# EAGLE board loa_v2c (EAGLE 6.5.0), part 1 of 2
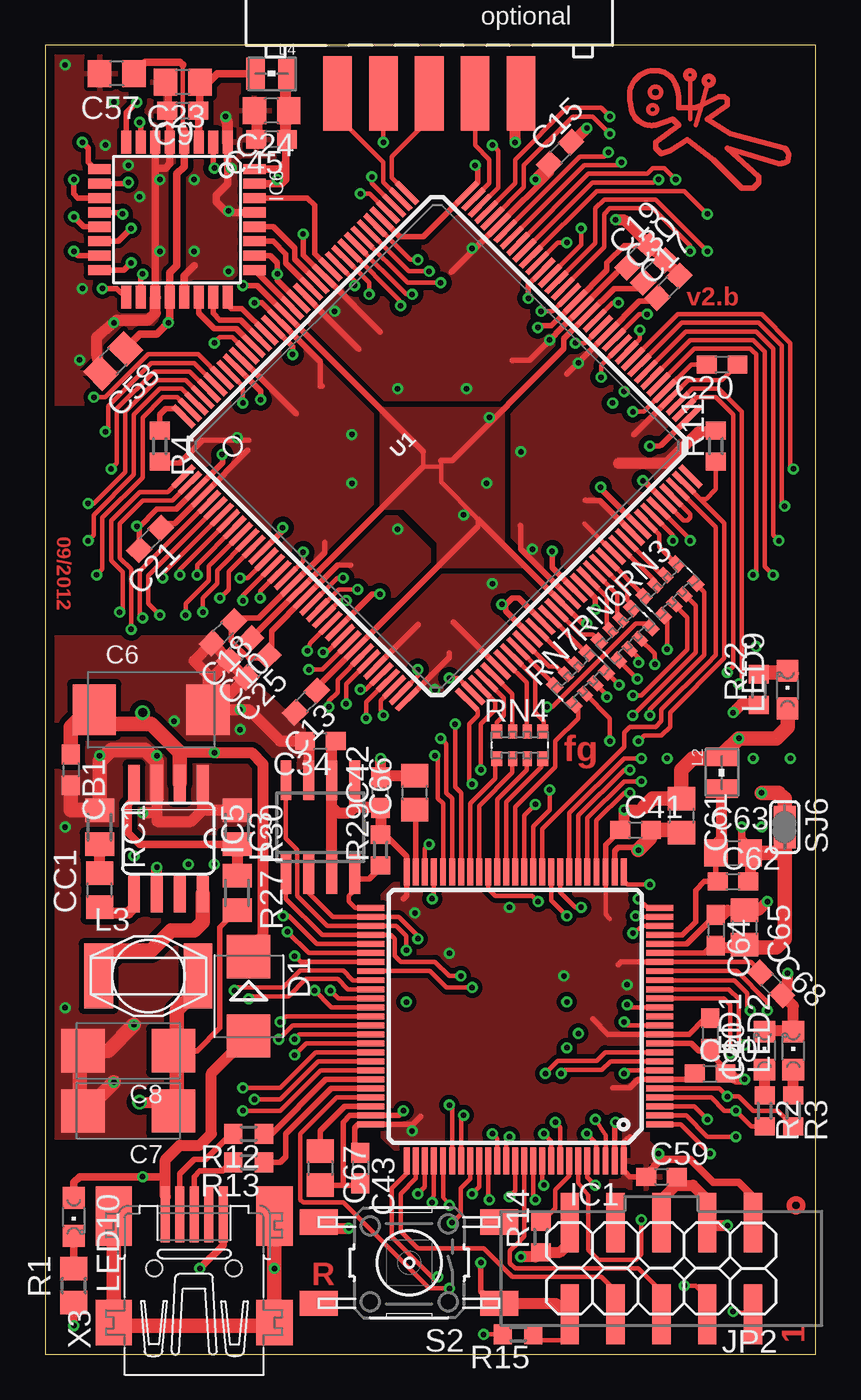
[diagram p7: board, top side]
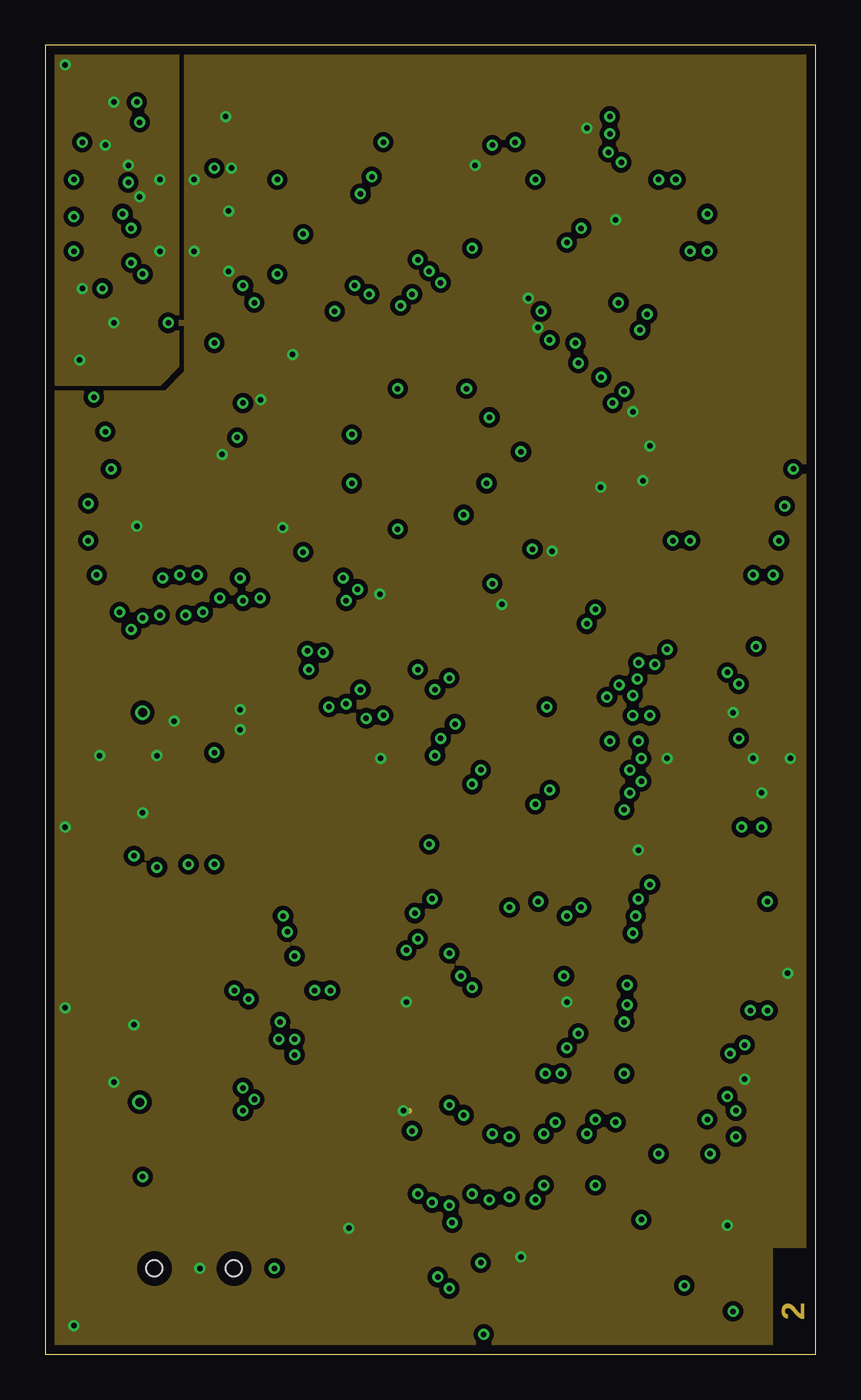
[diagram p8: board, inner layer GND]
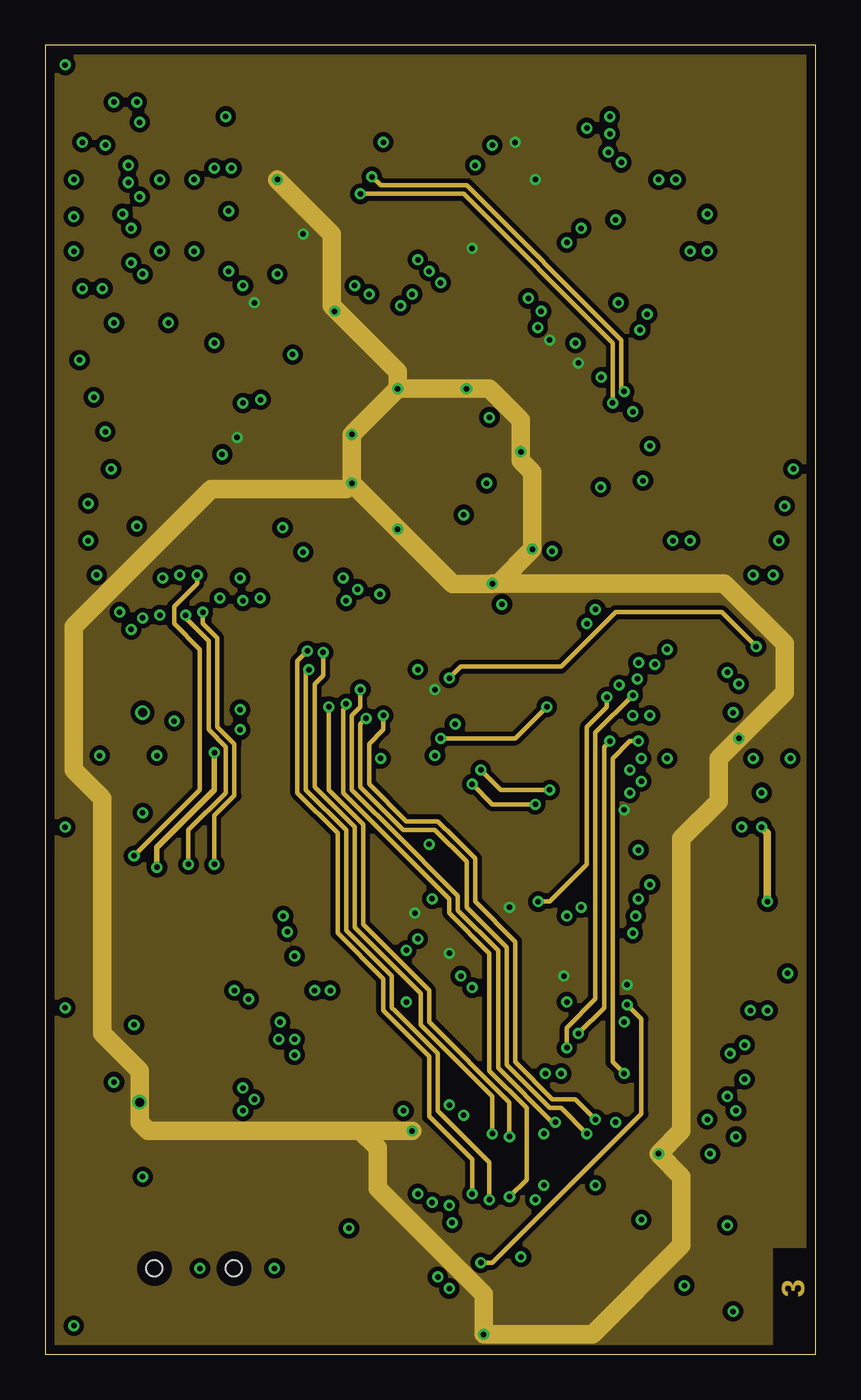
[diagram p9: board, inner layer Route15]
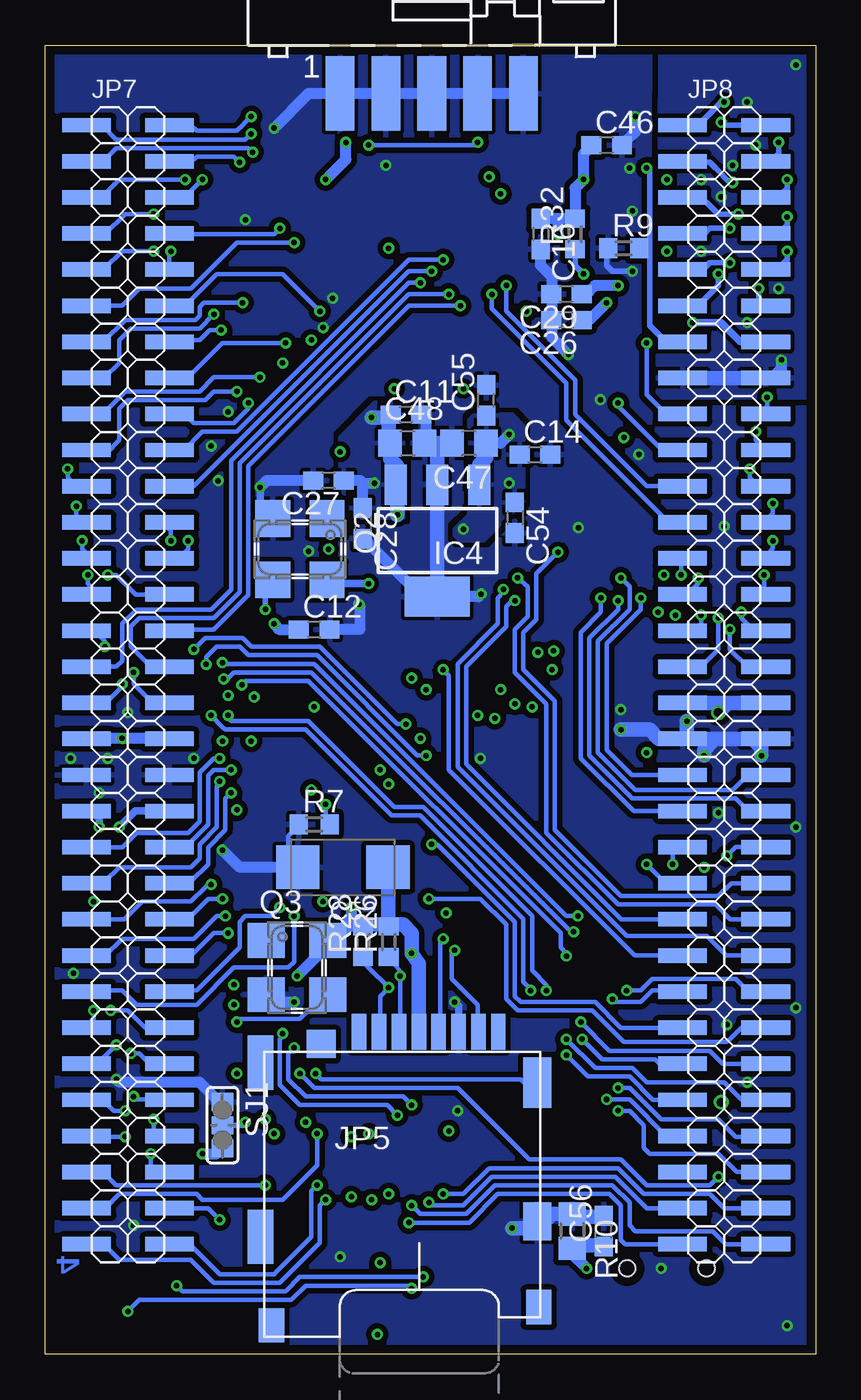
[diagram p10: board, bottom side, seen from below]

Size 42.68 x 72.54 mm. Coordinates in mm from the lower left corner, seen from the top.
Outline: 0,0 42.68,0 42.68,72.54 0,72.54 0,0
Copper layers (1+2*15+16): Top 0.035mm / dielectric 1.5mm / GND 0.035mm / dielectric 0.15mm / Route15 0.035mm / dielectric 0.2mm / Bottom 0.035mm
Design rules "PCB-POOL *": minimum track width 6mil, minimum drill 12mil, track to track 6mil, track to pad 6mil, pad to pad 6mil, via to via 6mil, smd to smd 6mil, copper to edge 20mil, drill to drill 8mil, minimum pad ring 8mil, minimum via ring 6mil, stop-mask expansion 12mil, vias tented up to drill 12mil, thermal gap 8mil

## Footprints (pad centres in the part's own frame; a part is rotated, then mirrored left to right if it is on the bottom)
SMC_D = smd 2.4 x 2.8: + -3.15,0; - 3.15,0
SMC_C = smd 2.4 x 2.4: + -2.5,0; - 2.5,0
C0603 = smd 1.1 x 1: 1 -0.85,0; 2 0.85,0
C0805 = smd 1.3 x 1.5: 1 -0.95,0; 2 0.95,0
SMB = smd 2.4 x 2.4: A 2.2,0; C -2.2,0
TQFP100 = smd 1.5 x 0.33: 1 -8,6; 2 -8,5.5; 3 -8,5; 4 -8,4.5; 5 -8,4; 6 -8,3.5; 7 -8,3; 8 -8,2.5; 9 -8,2; 10 -8,1.5; 11 -8,1; 12 -8,0.5; 13 -8,0; 14 -8,-0.5; 15 -8,-1; 16 -8,-1.5; 17 -8,-2; 18 -8,-2.5; 19 -8,-3; 20 -8,-3.5; 21 -8,-4; 22 -8,-4.5; 23 -8,-5; 24 -8,-5.5; 25 -8,-6; 51 8,-6; 52 8,-5.5; 53 8,-5; 54 8,-4.5; 55 8,-4; 56 8,-3.5; 57 8,-3; 58 8,-2.5; 59 8,-2; 60 8,-1.5; 61 8,-1; 62 8,-0.5; 63 8,0; 64 8,0.5; 65 8,1; 66 8,1.5; 67 8,2; 68 8,2.5; 69 8,3; 70 8,3.5; 71 8,4; 72 8,4.5; 73 8,5; 74 8,5.5; 75 8,6 | smd 0.33 x 1.5: 26 -6,-8; 27 -5.5,-8; 28 -5,-8; 29 -4.5,-8; 30 -4,-8; 31 -3.5,-8; 32 -3,-8; 33 -2.5,-8; 34 -2,-8; 35 -1.5,-8; 36 -1,-8; 37 -0.5,-8; 38 0,-8; 39 0.5,-8; 40 1,-8; 41 1.5,-8; 42 2,-8; 43 2.5,-8; 44 3,-8; 45 3.5,-8; 46 4,-8; 47 4.5,-8; 48 5,-8; 49 5.5,-8; 50 6,-8; 76 6,8; 77 5.5,8; 78 5,8; 79 4.5,8; 80 4,8; 81 3.5,8; 82 3,8; 83 2.5,8; 84 2,8; 85 1.5,8; 86 1,8; 87 0.5,8; 88 0,8; 89 -0.5,8; 90 -1,8; 91 -1.5,8; 92 -2,8; 93 -2.5,8; 94 -3,8; 95 -3.5,8; 96 -4,8; 97 -4.5,8; 98 -5,8; 99 -5.5,8; 100 -6,8
SO08 = smd 0.6 x 2.2: 1 -1.905,-2.6; 2 -0.635,-2.6; 3 0.635,-2.6; 4 1.905,-2.6; 5 1.905,2.6; 6 0.635,2.6; 7 -0.635,2.6; 8 -1.905,2.6
SOT223 = smd 1.219 x 2.235: 1 -2.311,-3.099; 2 0,-3.099; 3 2.311,-3.099 | smd 3.6 x 2.2: 4 0,3.099
SO08' = smd 0.66 x 2.032: 1 -1.905,-3.073; 2 -0.635,-3.073; 3 0.635,-3.073; 4 1.905,-3.073; 5 1.905,3.073; 6 0.635,3.073; 7 -0.635,3.073; 8 -1.905,3.073
TQFP32-08 = smd 1.27 x 0.559: 1 -4.293,2.8; 2 -4.293,2; 3 -4.293,1.2; 4 -4.293,0.4; 5 -4.293,-0.4; 6 -4.293,-1.2; 7 -4.293,-2; 8 -4.293,-2.8; 17 4.293,-2.8; 18 4.293,-2; 19 4.293,-1.2; 20 4.293,-0.4; 21 4.293,0.4; 22 4.293,1.2; 23 4.293,2; 24 4.293,2.8 | smd 0.559 x 1.27: 9 -2.8,-4.293; 10 -2,-4.293; 11 -1.2,-4.293; 12 -0.4,-4.293; 13 0.4,-4.293; 14 1.2,-4.293; 15 2,-4.293; 16 2.8,-4.293; 25 2.8,4.293; 26 2,4.293; 27 1.2,4.293; 28 0.4,4.293; 29 -0.4,4.293; 30 -1.2,4.293; 31 -2,4.293; 32 -2.8,4.293
2X05SMD = smd 1.016 x 3.302: 1 -5.08,-2.54; 2 -5.08,2.54; 3 -2.54,-2.54; 4 -2.54,2.54; 5 0,-2.54; 6 0,2.54; 7 2.54,-2.54; 8 2.54,2.54; 9 5.08,-2.54; 10 5.08,2.54
ML10S = smd 1.587 x 4.127: 1 -5.08,-0.635; 3 -2.54,-0.635; 5 0,-0.635; 7 2.54,-0.635; 9 5.08,-0.635 | smd 1.587 x 4.127 bottom: 2 -5.08,-0.635; 4 -2.54,-0.635; 6 0,-0.635; 8 2.54,-0.635; 10 5.08,-0.635
SD_MOLEX_49225-0821 = smd 0.8 x 2: 1 -2.43,8.5; 2 -1.33,8.5; 3 -0.23,8.5; 4 0.87,8.5; 5 1.97,8.5; 6 3.07,8.5; 7 4.17,8.5; 8 5.27,8.5 | smd 1.4 x 1.9: 11 7.51,-6.75; 12 -7.29,-7.75 | smd 1.4 x 3: 13 -7.89,-2.85; 14 -7.89,6.8 | smd 1.6 x 1.55: 15 -4.53,7.825 | smd 1.55 x 2.8: SW1 7.435,5.7 | smd 1.55 x 2.1: SW2 7.435,-2
2X32M_SMD = smd 0.8 x 2.7: 1 -30,-2.3; 2 -30,2.3; 3 -28,-2.3; 4 -28,2.3; 5 -26,-2.3; 6 -26,2.3; 7 -24,-2.3; 8 -24,2.3; 9 -22,-2.3; 10 -22,2.3; 11 -20,-2.3; 12 -20,2.3; 13 -18,-2.3; 14 -18,2.3; 15 -16,-2.3; 16 -16,2.3; 17 -14,-2.3; 18 -14,2.3; 19 -12,-2.3; 20 -12,2.3; 21 -10,-2.3; 22 -10,2.3; 23 -8,-2.3; 24 -8,2.3; 25 -6,-2.3; 26 -6,2.3; 27 -4,-2.3; 28 -4,2.3; 29 -2,-2.3; 30 -2,2.3; 31 0,-2.3; 32 0,2.3; 33 2,-2.3; 34 2,2.3; 35 4,-2.3; 36 4,2.3; 37 6,-2.3; 38 6,2.3; 39 8,-2.3; 40 8,2.3; 41 10,-2.3; 42 10,2.3; 43 12,-2.3; 44 12,2.3; 45 14,-2.3; 46 14,2.3; 47 16,-2.3; 48 16,2.3; 49 18,-2.3; 50 18,2.3; 51 20,-2.3; 52 20,2.3; 53 22,-2.3; 54 22,2.3; 55 24,-2.3; 56 24,2.3; 57 26,-2.3; 58 26,2.3; 59 28,-2.3; 60 28,2.3; 61 30,-2.3; 62 30,2.3; 63 32,-2.3; 64 32,2.3
WE-KI_0805_B = smd 1.02 x 1.78: 1 -0.89,0; 2 0.89,0
L-PISG = smd 1.6 x 3.6: 1 -2.75,0; 2 2.75,0
CHIPLED_0805 = smd 1.2 x 1.2: A 0,-1.05; C 0,1.05
XO53 = smd 1.93 x 2.032: 1 -1.5,-1.7; 2 1.5,-1.7; 3 1.5,1.7; 4 -1.5,1.7
R0805 = smd 1.3 x 1.5: 1 -0.95,0; 2 0.95,0
R0603 = smd 1 x 1.1: 1 -0.85,0; 2 0.85,0
M0805 = smd 1.3 x 1.6: 1 -0.95,0; 2 0.95,0
EXB38V = smd 0.6 x 0.8: 1 -1.275,-0.75; 4 1.275,-0.75; 5 1.275,0.75; 8 -1.275,0.75 | smd 0.5 x 0.8: 2 -0.4,-0.75; 3 0.4,-0.75; 6 0.4,0.75; 7 -0.4,0.75
B3F-10XX-SMD = smd 2.1 x 1.4: P1 -5,2.25; P2 5,2.25; P3 -5,-2.25; P4 5,-2.25
SJ_2S = smd 1 x 1.2: 1 -1.286,0; 2 0,0; 3 1.286,0
SJS = smd 1 x 1.2: 1 -0.683,0; 2 0.683,0
TQ144 = smd 1.6 x 0.3: P1 -11.1,8.75; P2 -11.1,8.25; P3 -11.1,7.75; P4 -11.1,7.25; P5 -11.1,6.75; P6 -11.1,6.25; P7 -11.1,5.75; P8 -11.1,5.25; P9 -11.1,4.75; P10 -11.1,4.25; P11 -11.1,3.75; P12 -11.1,3.25; P13 -11.1,2.75; P14 -11.1,2.25; P15 -11.1,1.75; P16 -11.1,1.25; P17 -11.1,0.75; P18 -11.1,0.25; P19 -11.1,-0.25; P20 -11.1,-0.75; P21 -11.1,-1.25; P22 -11.1,-1.75; P23 -11.1,-2.25; P24 -11.1,-2.75; P25 -11.1,-3.25; P26 -11.1,-3.75; P27 -11.1,-4.25; P28 -11.1,-4.75; P29 -11.1,-5.25; P30 -11.1,-5.75; P31 -11.1,-6.25; P32 -11.1,-6.75; P33 -11.1,-7.25; P34 -11.1,-7.75; P35 -11.1,-8.25; P36 -11.1,-8.75; P73 11.1,-8.75; P74 11.1,-8.25; P75 11.1,-7.75; P76 11.1,-7.25; P77 11.1,-6.75; P78 11.1,-6.25; P79 11.1,-5.75; P80 11.1,-5.25; P81 11.1,-4.75; P82 11.1,-4.25; P83 11.1,-3.75; P84 11.1,-3.25; P85 11.1,-2.75; P86 11.1,-2.25; P87 11.1,-1.75; P88 11.1,-1.25; P89 11.1,-0.75; P90 11.1,-0.25; P91 11.1,0.25; P92 11.1,0.75; P93 11.1,1.25; P94 11.1,1.75; P95 11.1,2.25; P96 11.1,2.75; P97 11.1,3.25; P98 11.1,3.75; P99 11.1,4.25; P100 11.1,4.75; P101 11.1,5.25; P102 11.1,5.75; P103 11.1,6.25; P104 11.1,6.75; P105 11.1,7.25; P106 11.1,7.75; P107 11.1,8.25; P108 11.1,8.75 | smd 0.3 x 1.6: P37 -8.75,-11.1; P38 -8.25,-11.1; P39 -7.75,-11.1; P40 -7.25,-11.1; P41 -6.75,-11.1; P42 -6.25,-11.1; P43 -5.75,-11.1; P44 -5.25,-11.1; P45 -4.75,-11.1; P46 -4.25,-11.1; P47 -3.75,-11.1; P48 -3.25,-11.1; P49 -2.75,-11.1; P50 -2.25,-11.1; P51 -1.75,-11.1; P52 -1.25,-11.1; P53 -0.75,-11.1; P54 -0.25,-11.1; P55 0.25,-11.1; P56 0.75,-11.1; P57 1.25,-11.1; P58 1.75,-11.1; P59 2.25,-11.1; P60 2.75,-11.1; P61 3.25,-11.1; P62 3.75,-11.1; P63 4.25,-11.1; P64 4.75,-11.1; P65 5.25,-11.1; P66 5.75,-11.1; P67 6.25,-11.1; P68 6.75,-11.1; P69 7.25,-11.1; P70 7.75,-11.1; P71 8.25,-11.1; P72 8.75,-11.1; P109 8.75,11.1; P110 8.25,11.1; P111 7.75,11.1; P112 7.25,11.1; P113 6.75,11.1; P114 6.25,11.1; P115 5.75,11.1; P116 5.25,11.1; P117 4.75,11.1; P118 4.25,11.1; P119 3.75,11.1; P120 3.25,11.1; P121 2.75,11.1; P122 2.25,11.1; P123 1.75,11.1; P124 1.25,11.1; P125 0.75,11.1; P126 0.25,11.1; P127 -0.25,11.1; P128 -0.75,11.1; P129 -1.25,11.1; P130 -1.75,11.1; P131 -2.25,11.1; P132 -2.75,11.1; P133 -3.25,11.1; P134 -3.75,11.1; P135 -4.25,11.1; P136 -4.75,11.1; P137 -5.25,11.1; P138 -5.75,11.1; P139 -6.25,11.1; P140 -6.75,11.1; P141 -7.25,11.1; P142 -7.75,11.1; P143 -8.25,11.1; P144 -8.75,11.1
32005-201 = smd 3.1 x 0.5: 1 3,1.6; 2 3,0.8; 3 3,0; 4 3,-0.8; 5 3,-1.6 | smd 2.5 x 2: M1 -3,-4.45; M2 -3,4.45 | smd 3.3 x 2: M3 2.9,4.45; M4 2.9,-4.45 | hole 0.9: 0,2.2; 0,-2.2

## Placement (x,y rotation side)
C6  22µ  [SMC_D]  5.87,35.72 0 top
C7  22µ  [SMC_C]  4.6,13.49 180 top
C8  22µ  [SMC_C]  4.6,16.83 180 top
C9  100n  [C0603]  7.62,68.9 180 top
C10  10n  [C0603]  10.79,39.05 225 top
C11  10n  [C0603]  22.7,52.07 0 bottom
C12  10n  [C0603]  27.78,40.16 0 bottom
C13  10n  [C0603]  14.45,36.17 225 top
C14  100n  [C0603]  15.56,49.85 0 bottom
C15  100n  [C0603]  28.52,66.55 45 top
C16  100n  [C0603]  15.24,62.07 270 bottom
C17  100n  [C0603]  34.51,59.15 45 top
C18  100n  [C0603]  9.84,40.01 225 top
C19  100n  [C0603]  32.86,60.84 45 top
C20  100n  [C0603]  37.49,54.84 180 top
C21  100n  [C0603]  5.81,45.18 225 top
C23  1µ  [C0805]  7.62,70.48 180 top
C24  1µ  [C0805]  12.54,68.9 180 top
C25  100n  [C0603]  11.75,38.1 225 top
C26  100n  [C0603]  13.81,57.31 180 bottom
C27  100n  [C0603]  26.99,48.42 180 bottom
C28  100n  [C0603]  25.08,46.04 270 bottom
C29  100n  [C0603]  13.81,58.74 180 bottom
C30  100n  [C0603]  33.72,60.01 45 top
C34  100n  [C0603]  15.24,33.97 180 top
C40  100n  [C0603]  36.83,17.78 270 top
C41  100n  [C0603]  32.7,29.05 0 top
C42  100n  [C0603]  18.57,31.11 90 top
C43  100n  [C0603]  17.46,10.32 270 top
C45  100n  [C0603]  12.54,67.31 180 top
C46  100n  [C0603]  11.59,66.99 0 bottom
C47  4µ7  [C0805]  19.21,50.48 180 bottom
C48  1µ  [C0805]  22.62,50.48 0 bottom
C52  22µ  [SMC_C]  26.19,26.99 180 bottom
C54  100n  [C0603]  16.67,46.35 270 bottom
C55  100n  [C0603]  18.26,52.86 90 bottom
C56  10n  [C0603]  11.75,6.83 90 bottom
C57  470n  [C0805]  3.97,70.96 180 top
C58  470n  [C0805]  3.76,55.04 225 top
C59  100n  [C0603]  34.13,9.84 0 top
C60  100n  [C0603]  36.83,15.56 0 top
C61  4u7  [C0805]  35.24,29.84 270 top
C62  1n  [C0603]  38.1,26.19 0 top
C63  1µ  [C0805]  38.1,27.78 0 top
C64  1n  [C0603]  37.15,23.5 270 top
C65  1µ  [C0805]  38.73,23.65 270 top
C66  2u2  [C0805]  20.48,31.12 90 top
C67  2u2  [C0805]  15.24,10.32 270 top
C68  100n  [C0603]  40.21,20.53 315 top
CB1  100n  [C0603]  1.43,32.39 270 top
CC1  6n8  [C0805]  3.02,25.72 90 top
D1  MURS 140  [SMB]  11.27,19.84 270 top
IC1  STM32F10XVXT6  [TQFP100]  26.04,18.73 180 top
IC3  AT45DB081D-SU  [SO08]  15.24,29.21 0 top
IC4  MCP1825S-1202E/DB  [SOT223]  20.95,45.09 180 bottom
IC5  NCP3170  [SO08']  6.83,28.57 180 top
IC6  AD7266SU  [TQFP32-08]  7.3,62.87 270 top
JP2  CORTEX_JTAGS  [2X05SMD]  34.13,4.76 180 top
JP3  [ML10S]  21.27,70.48 0 bottom
JP5  SD_DETECT  [SD_MOLEX_49225-0821]  22.86,9.37 0 bottom
JP7  right  [2X32M_SMD]  38.1,38.1 270 bottom
JP8  left  [2X32M_SMD]  5.08,38.1 270 bottom
L2  0,68u  [WE-KI_0805_B]  37.47,32.23 270 top
L3  4µ7  [L-PISG]  5.71,20.96 0 top
L4  0,68u  [WE-KI_0805_B]  12.54,70.96 180 top
LED1  Red  [CHIPLED_0805]  39.85,16.83 0 top
LED2  Red  [CHIPLED_0805]  41.43,16.83 0 top
LED9  Green  [CHIPLED_0805]  41.12,36.83 0 top
LED10  Blue  [CHIPLED_0805]  1.59,7.62 180 top
Q2  50.000  [XO53]  28.57,44.61 180 bottom
Q3  25.000  [XO53]  28.73,21.43 270 bottom
R1  820  [R0805]  1.59,3.81 90 top
R2  330  [R0603]  39.85,13.49 270 top
R3  330  [R0603]  41.43,13.49 270 top
R4  330  [R0603]  6.35,50.32 270 top
R7  10k  [R0603]  27.78,29.37 0 bottom
R9  10k  [R0603]  10.64,61.28 0 bottom
R10  1M  [R0805]  13.49,6.83 270 bottom
R11  330  [R0603]  37.15,50.32 90 top
R12  22  [R0603]  11.27,12.22 180 top
R13  22  [R0603]  11.27,10.64 180 top
R14  100k  [R0603]  27.46,6.51 90 top
R15  10k  [R0603]  26.19,1.11 180 top
R22  330  [R0603]  39.53,36.83 90 top
R26  10k  [R0603]  23.65,22.86 90 bottom
R27  24k9  [M0805]  10.64,25.56 270 top
R28  10k  [R0603]  25.08,22.86 90 bottom
R29  10k  [R0603]  18.57,27.94 90 top
R30  8k06  [M0805]  10.64,29.21 270 top
R32  10k  [R0603]  13.34,62.07 90 bottom
RC1  4k99  [M0805]  3.02,29.21 270 top
RN3  33  [EXB38V]  34.6,42.36 45 top
RN4  33  [EXB38V]  26.29,33.76 0 top
RN6  33  [EXB38V]  32.13,39.89 45 top
RN7  33  [EXB38V]  29.66,37.42 45 top
S2  Reset  [B3F-10XX-SMD]  20.16,5.08 180 top
SJ1  PDR_ON  [SJ_2S]  32.86,12.7 270 bottom
SJ6  [SJS]  40.96,29.21 270 top
U1  6SLX9TQG144  [TQ144]  21.71,50.31 45 top
X3  MINI-USB  [32005-201]  8.25,4.76 90 top